# Altium schematic sheet Regulator-Buck - TPS652211.SchDoc
size A4
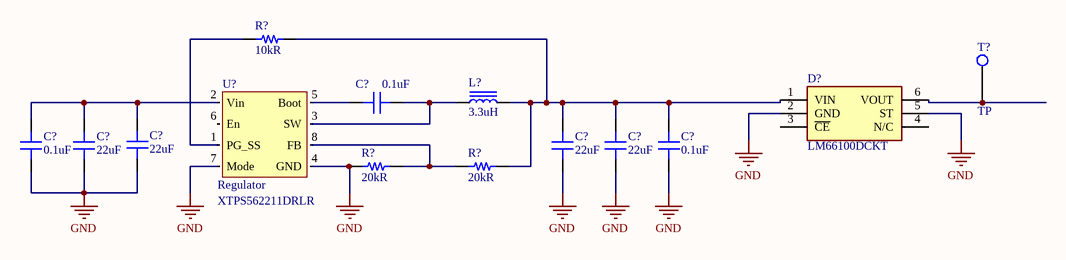
[diagram p0: Regulator-Buck - TPS652211.SchDoc]

## Parts
(Parts that share a designator on the sheet are numbered #1, #2 ... from top to bottom, then left to right.)
C?#1  0.1uF  [CAP 0603_1608]
C?#2  0.1uF  [CAP 0603_1608]
C?#3  22uF  [CAP 1206_3216 - 1.8MM]
C?#4  22uF  [CAP 1206_3216 - 1.8MM]
C?#5  22uF  [CAP 1206_3216 - 1.8MM]
C?#6  22uF  [CAP 1206_3216 - 1.8MM]
C?#7  0.1uF  [CAP 0603_1608]
D?  LM66100DCKT  [SC70-6]
L?  3.3uH  [IND 1616_4040]
R?#1  10kR  [RES 0603_1608]
R?#2  20kR  [RES 0603_1608]
R?#3  20kR  [RES 0603_1608]
T?  TP  [TP]
U?  Regulator  Manufacturer Part Number: XTPS562211DRLR  [SOT-5X3]

## Nets
GND: C?#2.1 C?#3.1 C?#4.1 C?#5.1 C?#6.1 C?#7.1 D?.2(GND) D?.5(ST) R?#2.2 U?.4(GND) U?.7(Mode)
NetC?#1_1: C?#1.1 L?.1 U?.3(SW)
NetC?#1_2: C?#1.2 U?.5(Boot)
NetC?#2_2: C?#2.2 C?#3.2 C?#4.2 U?.2(Vin)
NetC?#5_2: C?#5.2 C?#6.2 C?#7.2 D?.1(VIN) L?.2 R?#1.2 R?#3.2
NetD?_6: D?.6(VOUT) T?.1
NetR?#1_1: R?#1.1 U?.1(PG_SS)
NetR?#2_1: R?#2.1 R?#3.1 U?.8(FB)

Not connected (* = marked no-connect by the designer): D? 3(~{CE}) 4(N/C); U? 6(En)

## Library data of the parts
C?#1 C?#2 C?#7 = C0603C104K5RACTU: KEMET - C0603C104K5RACTU - SMD Multilayer Cer; Dielectric Material: Ceramic; Capacitance: 100nF; Tolerance: 10%; Voltage Rating (DC): 50V; Dielectric: X7R; Part Number: C0603C104K5RACTU; Value: 0.1uF; Part Name: C0603C104K5RACTU; Supplier 1: Mouser; Supplier Part Number 1: 80-C0603C104K5R; Manufacturer: KEMET; Manufacturer Part Number: C0603C104K5RACTU; RoHS: Yes; Category: Ceramic Capacitors; Stock 1: 3092110; Pricing 1: 1=0.26000, 10=0.11800, 50=0.11800, 100=0.0730; Mount: Surface Mount; Case/Package: 0603; Case Code (Metric): 1608; Case Code (Imperial): 0603; Min Operating Temperature: -55°C; Max Operating Temperature: 125°C; Packaging: Tape and Reel; Package Quantity: 4000; Termination: SMD/SMT; Voltage: 50V; Length: 1.6mm; Width: 0.8mm; RoHS Compliant: Yes; ComponentLink1URL: https://datasheet.ciiva.com/29242/457901-da-0; ComponentLink1Description: https://datasheet.ciiva.com/29242/457901-da-0; Supplier 2: Mouser; Supplier Part Number 2: 80-C0603C104K5RAC; Stock 2: 377106; Pricing 2: 1=0.26000, 10=0.11800, 50=0.11800, 100=0.0730; Material: Ceramic
C?#3-C?#6 = C1206C226K8RAC7210: Multilayer Ceramic Capacitors MLCC - SMD/SMT; Manufacturer: KEMET; Voltage Rating: 10V; Tolerance: 10%; Dielectric: X7R; Part Number: C1206C226K8RAC7210; Supplier 1: Mouser; Supplier Part Number 1: 80-C1206C226K8R7210; Manufacturer Part Number: C1206C226K8RAC7210; RoHS: Yes; Category: Ceramic Capacitors; Stock 1: 6850; Pricing 1: 1=2.44000, 10=1.88000, 50=1.88000, 100=1.2000; Mount: Surface Mount; Case/Package: 1206; Number of Pins: 2; Case Code (Metric): 3216; Case Code (Imperial): 1206; Dielectric Material: Ceramic; Min Operating Temperature: -55°C; Max Operating Temperature: 125°C; Package Quantity: 1; Capacitance: 22uF; Voltage Rating (DC): 10V; Termination: SMD/SMT; Voltage: 10V; RoHS Compliant: Yes; Value: 22uF; Part Name: C1206C226K8RAC7210
D? = LM66100DCKT: 1.5-V to 5.5-V, 1.5-A, 0.5-uA IQ ideal diode; Manufacturer: Texas Instruments; Part Number: LM66100DCKT; Supplier 1: Mouser; Supplier Part Number 1: 595-LM66100DCKT; Manufacturer Part Number: LM66100DCKT; RoHS: Yes; Category: Integrated Circuits (ICs); Stock 1: 15085; Pricing 1: 1=0.50000, 10=0.37000, 50=0.37000, 100=0.2490
L? = XAL4030-332MEC: Fixed Inductors XAL4030 AEC-Q200 3.3 uH 20 %; Manufacturer: Coilcraft; Core Material: Composite; Tolerance: 20%; Self Resonant Frequency: 43MHz; Shielding: Shielded; Max DC Current: 6.6A; DC Resistance (DCR): 28.6mR; Test Frequency: 100kHz; Saturation Current: 5.5A; Part Number: XAL4030-332MEC; Value: 3.3uH; Part Name: XAL4030-332MEC; Supplier 1: Mouser; Supplier Part Number 1: 994-XAL4030-332MEC; Manufacturer Part Number: XAL4030-332MEC; RoHS: Yes; Category: Fixed Inductors; Pricing 1: 1=2.01000, 10=1.92000, 50=1.87000, 100=1.6300; Mount: Surface Mount; Case/Package: SMD/SMT; Min Operating Temperature: -40°C; Max Operating Temperature: 125°C; Packaging: Tape and Reel; Package Quantity: 500; Inductance: 3.3uH; Termination: SMD/SMT; Series: XAL4030; Inductance Tolerance: 20%; RMS Current (Irms): 6.6A; Length: 4.3mm; Width: 4.3mm; Height: 3.1mm; Lead Free: Contains Lead; RoHS Compliant: Yes; REACH SVHC: No SVHC; ComponentLink1URL: https://datasheet.ciiva.com/22680/1681987-226; ComponentLink1Description: https://datasheet.ciiva.com/22680/1681987-226; ComponentLink2URL: https://datasheet.ciiva.com/22701/1681987-227; ComponentLink2Description: https://datasheet.ciiva.com/22701/1681987-227; ComponentLink3URL: https://datasheet.ciiva.com/13277/xal4000-270; ComponentLink3Description: https://datasheet.ciiva.com/13277/xal4000-270
R?#1 = TNPW060310K0BYEN: Res Thin Film 0603 10K Ohm 0.1% 1/10W 10ppm/C; Manufacturer: Vishay; Temperature Coefficient: 10ppm/°C; Power Rating: 100mW; Part Number: TNPW060310K0BYEN; Value: 10kR; Case/Package: 0603; Contact Plating: Tin; Part Name: TNPW060310K0BYEN; Supplier 1: Mouser; Supplier Part Number 1: 71-TNPW060310K0BYEN; Manufacturer Part Number: TNPW060310K0BYEN; RoHS: Yes; Category: Chip SMD Resistors; Stock 1: 3725; Pricing 1: 1=0.76000, 10=0.66000, 50=0.66000, 100=0.4600; Mount: Surface Mount; Min Operating Temperature: -55°C; Max Operating Temperature: 125°C; Resistance: 10kR; Tolerance: 0.1%; Resistor Type: Thin Film; Packaging: Tape and Reel; Construction: Rectangular; Technology: THIN FILM; Series: TNPW; Length: 1.6mm; Height: 0.45mm; Depth: 0.85mm; Radiation Hardening: No; Military Standard: Not; RoHS Compliant: Yes; ComponentLink1URL: https://datasheet.ciiva.com/11811/0900766b80d; ComponentLink1Description: https://datasheet.ciiva.com/11811/0900766b80d; ComponentLink2URL: https://datasheet.ciiva.com/9052/tnpw-e3-9052; ComponentLink2Description: https://datasheet.ciiva.com/9052/tnpw-e3-9052; ComponentLink3URL: https://datasheet.ciiva.com/17190/tnpw-e3-171; ComponentLink3Description: https://datasheet.ciiva.com/17190/tnpw-e3-171; Case Code (Imperial): 0603; Case Code (Metric): 1608
R?#2 R?#3 = TNPW060320K0BEEN: VISHAY         TNPW060320K0BEEN            RE; Manufacturer: Vishay Dale; Tolerance: 0.1%; Temperature Coefficient: 25ppm/°C; Power Rating: 100mW; Voltage Rating: 75V; Part Number: TNPW060320K0BEEN; Value: 20kR; Case/Package: 0603; Contact Plating: Tin; Part Name: TNPW060320K0BEEN; Supplier 1: Mouser; Supplier Part Number 1: 71-TNPW060320K0BEEN; Manufacturer Part Number: TNPW060320K0BEEN; RoHS: Yes; Category: Chip SMD Resistors; Stock 1: 454; Pricing 1: 1=0.87000, 10=0.75900, 50=0.75900, 100=0.5290; Min Operating Temperature: -55°C; Max Operating Temperature: 125°C; Resistance: 20kR; Resistor Type: Thin Film; Packaging: Tape and Reel; Construction: Rectangular; Technology: THIN FILM; Series: TNPW; Length: 1.6mm; Height: 0.45mm; Depth: 0.85mm; Radiation Hardening: No; Military Standard: Not; RoHS Compliant: Yes; ComponentLink1URL: https://datasheet.ciiva.com/48526/tnpw-e3-485; ComponentLink1Description: https://datasheet.ciiva.com/48526/tnpw-e3-485; ComponentLink2URL: https://datasheet.ciiva.com/28621/1354029-286; ComponentLink2Description: https://datasheet.ciiva.com/28621/1354029-286; Case Code (Imperial): 0603; Case Code (Metric): 1608; Weight: 7.1E-05oz; Termination: SMD/SMT; Package Quantity: 1000; Number of Terminations: 2; Max Power Dissipation: 100mW; Voltage Rating (DC): 75V; Features: Moisture Resistant,Automotive AEC-Q200,Anti-S; Resistance Tolerance: 0.1%; Width: 0.033inch; REACH SVHC: Unknown; Lead Free: Lead Free; Number of Pins: 2; Size Code: 0603
T? = Test Point 0.5mm: Part Number: Test Point 0.5mm; Part Name: Test Point 0.5mm
U? = XTPS562211DRLR: 4.2-V to 18-V, 2-A, synchronous buck converter with 1% accuracy, PG/SS and PFM/forced-PWM in SOT583; Manufacturer: TI; Number of Outputs: 1; Part Number: XTPS562211DRLR; Supplier 1: Texas Instruments; RoHS: Yes; Category: Power Supply Modules; Mount: Surface Mount; Number of Pins: 8; Min Operating Temperature: -40°C; Max Operating Temperature: 125°C; Packaging: Tape and Reel